# Altium schematic sheet EMMC.SchDoc
size A4 portrait; SheetNumber: 5; SheetTotal: 9
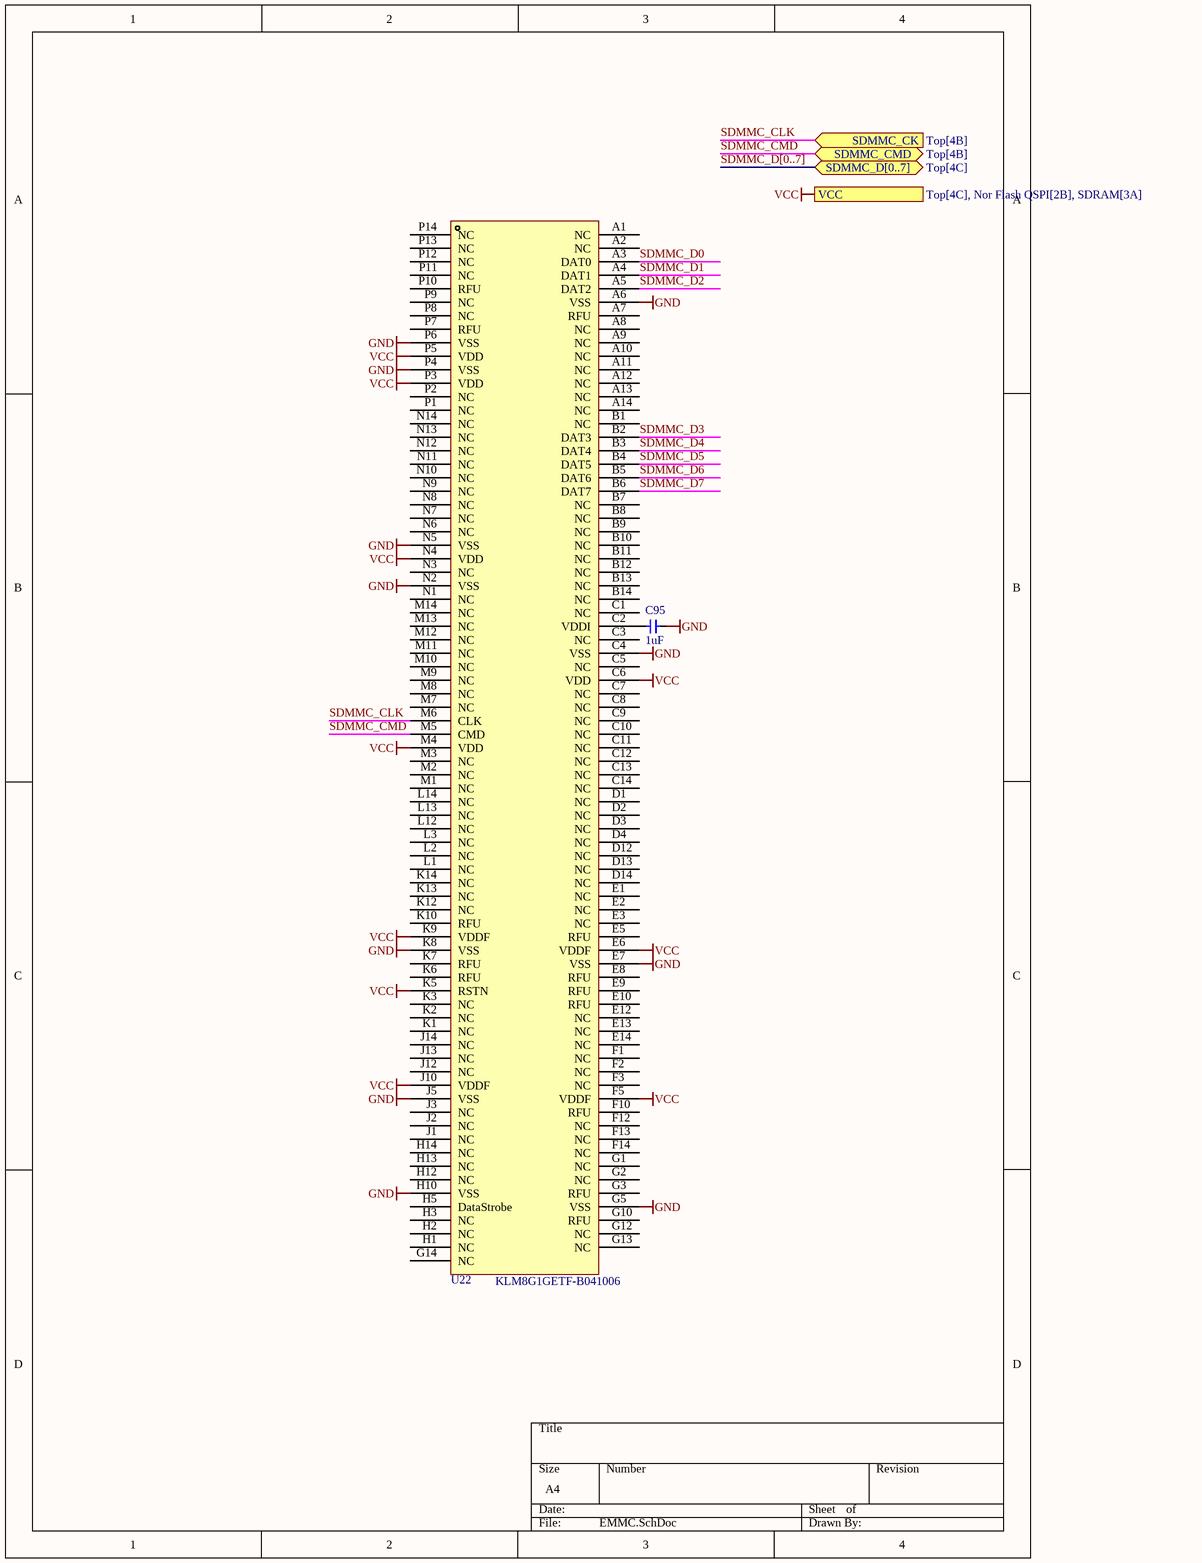
[diagram p0: EMMC.SchDoc]

## Parts
C95  1uF  [0402-C]
U22  KLM8G1GETF-B041006  [FBGA-153_L13.0-W11.5-P0.50_KLMAG1JETD-B041]

## Ports
SDMMC_CK (in, see Top[4B]), SDMMC_CMD (bidir, see Top[4B]), SDMMC_D[0..7] (bidir, see Top[4C]), VCC (see Top[4C], Nor Flash QSPI[2B], SDRAM[3A])

## Nets
GND: C95.2 U22.A6(VSS) U22.C4(VSS) U22.E7(VSS) U22.G5(VSS) U22.H10(VSS) U22.J5(VSS) U22.K8(VSS) U22.N2(VSS) U22.N5(VSS) U22.P4(VSS) U22.P6(VSS)
VCC: U22.C6(VDD) U22.E6(VDDF) U22.F5(VDDF) U22.J10(VDDF) U22.K5(RSTN) U22.K9(VDDF) U22.M4(VDD) U22.N4(VDD) U22.P3(VDD) U22.P5(VDD) ; port VCC
SDMMC_CLK: U22.M6(CLK) ; port SDMMC_CK
SDMMC_CMD: U22.M5(CMD) ; port SDMMC_CMD
SDMMC_D0: U22.A3(DAT0)
SDMMC_D1: U22.A4(DAT1)
SDMMC_D2: U22.A5(DAT2)
SDMMC_D3: U22.B2(DAT3)
SDMMC_D4: U22.B3(DAT4)
SDMMC_D5: U22.B4(DAT5)
SDMMC_D6: U22.B5(DAT6)
SDMMC_D7: U22.B6(DAT7)
NetC95_1: C95.1 U22.C2(VDDI)

Not connected (* = marked no-connect by the designer): U22 A1(NC) A2(NC) A7(RFU) A8(NC) A9(NC) A10(NC) A11(NC) A12(NC) A13(NC) A14(NC) B1(NC) B7(NC) B8(NC) B9(NC) B10(NC) B11(NC) B12(NC) B13(NC) B14(NC) C1(NC) C3(NC) C5(NC) C7(NC) C8(NC) C9(NC) C10(NC) C11(NC) C12(NC) C13(NC) C14(NC) D1(NC) D2(NC) D3(NC) D4(NC) D12(NC) D13(NC) D14(NC) E1(NC) E2(NC) E3(NC) E5(RFU) E8(RFU) E9(RFU) E10(RFU) E12(NC) E13(NC) E14(NC) F1(NC) F2(NC) F3(NC) F10(RFU) F12(NC) F13(NC) F14(NC) G1(NC) G2(NC) G3(RFU) G10(RFU) G12(NC) G13(NC) G14(NC) H1(NC) H2(NC) H3(NC) H5(DataStrobe) H12(NC) H13(NC) H14(NC) J1(NC) J2(NC) J3(NC) J12(NC) J13(NC) J14(NC) K1(NC) K2(NC) K3(NC) K6(RFU) K7(RFU) K10(RFU) K12(NC) K13(NC) K14(NC) L1(NC) L2(NC) L3(NC) L12(NC) L13(NC) L14(NC) M1(NC) M2(NC) M3(NC) M7(NC) M8(NC) M9(NC) M10(NC) M11(NC) M12(NC) M13(NC) M14(NC) N1(NC) N3(NC) N6(NC) N7(NC) N8(NC) N9(NC) N10(NC) N11(NC) N12(NC) N13(NC) N14(NC) P1(NC) P2(NC) P7(RFU) P8(NC) P9(NC) P10(RFU) P11(NC) P12(NC) P13(NC) P14(NC)

## Buses and harness runs
bus SDMMC_D[0..7] = port SDMMC_D[0..7]

## Library data of the parts
C95 = 电容-0402: Capacitor; Value: 0.1u
U22 = KLM8G1GETF-B041006: Manufacturer: SAMSUNG(三星半导体); Symbol: KLM8G1GETF-B041006_C20622996; Device: KLM8G1GETF-B041006_1; Add into BOM: yes; LCSC Part Name: KLM8G1GETF-B041006; Supplier Part: C20622996; Manufacturer Part: KLM8G1GETF-B041006; Supplier Footprint: FBGA-153(11.5x13); Datasheet: https://atta.szlcsc.com/upload/public/pdf/source/20240221/0DCF3FBB535A67C02EC39E54F7AEA7E4.pdf; Supplier: LCSC; Convert to PCB: yes